# Altium schematic sheet P5c_Filter1B.SchDoc
size A
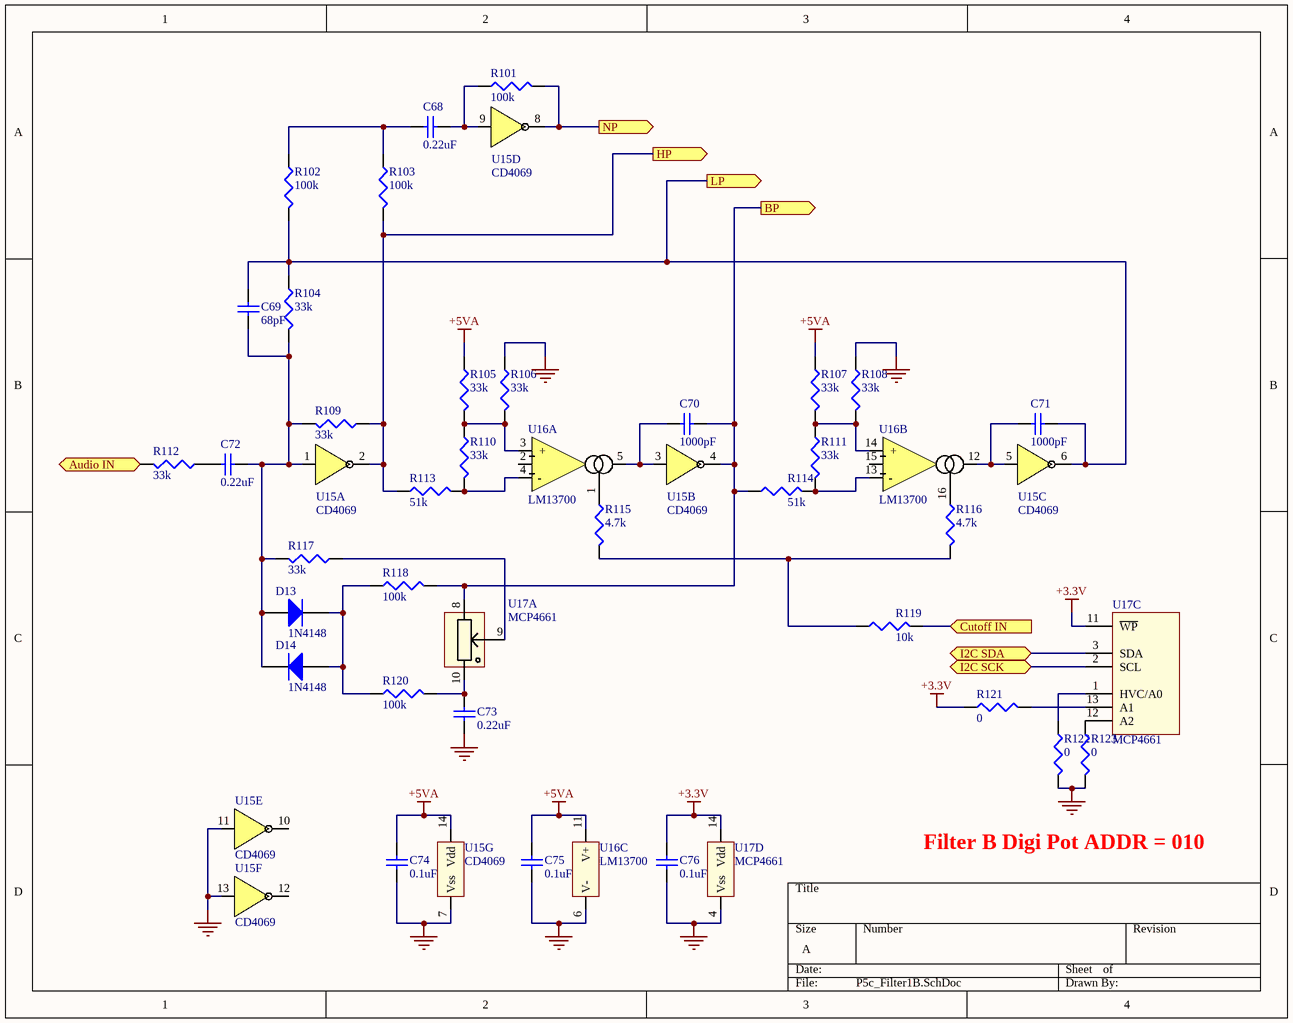
[diagram p0: P5c_Filter1B.SchDoc]

## Parts
C68  0.22uF  [CAP 0603 (1608 metric)]
C69  68pF  [CAP 0603 (1608 metric)]
C70  1000pF  [CAP 0603 (1608 metric)]
C71  1000pF  [CAP 0603 (1608 metric)]
C72  0.22uF  [CAP 0603 (1608 metric)]
C73  0.22uF  [CAP 0603 (1608 metric)]
C74  0.1uF  [CAP 0603 (1608 metric)]
C75  0.1uF  [CAP 0603 (1608 metric)]
C76  0.1uF  [CAP 0603 (1608 metric)]
D13  1N4148
D14  1N4148
R101  100k  [RES 0603 (1608 metric)]
R102  100k  [RES 0603 (1608 metric)]
R103  100k  [RES 0603 (1608 metric)]
R104  33k  [RES 0603 (1608 metric)]
R105  33k  [RES 0603 (1608 metric)]
R106  33k  [RES 0603 (1608 metric)]
R107  33k  [RES 0603 (1608 metric)]
R108  33k  [RES 0603 (1608 metric)]
R109  33k  [RES 0603 (1608 metric)]
R110  33k  [RES 0603 (1608 metric)]
R111  33k  [RES 0603 (1608 metric)]
R112  33k  [RES 0603 (1608 metric)]
R113  51k  [RES 0603 (1608 metric)]
R114  51k  [RES 0603 (1608 metric)]
R115  4.7k  [RES 0603 (1608 metric)]
R116  4.7k  [RES 0603 (1608 metric)]
R117  33k  [RES 0603 (1608 metric)]
R118  100k  [RES 0603 (1608 metric)]
R119  10k  [RES 0603 (1608 metric)]
R120  100k  [RES 0603 (1608 metric)]
R121  0  [RES 0603 (1608 metric)]
R122  0  [RES 0603 (1608 metric)]
R123  0  [RES 0603 (1608 metric)]
U15  CD4069  (parts A,B,C,D,E,F,G of 7)
U16  LM13700  (parts A,B,C of 3)
U17  MCP4661  (parts A,C,D of 4)

## Ports
Audio IN (in), BP (out), Cutoff IN (in), HP (out), I2C SCK, I2C SDA, LP (out), NP (out)

## Nets
+3.3V: C76.1 R121.1 U17.11(~{WP}) U17.14(Vdd)
+5VA: C74.1 C75.1 R105.1 R107.1 U15.14(Vdd) U16.11(V+)
GND: C73.2 C74.2 C75.2 C76.2 R106.1 R108.1 R122.2 R123.2 U15.7(Vss) U15.11(E) U15.13(F) U16.6(V-) U17.4(Vss)
Audio IN: R112.2 ; port Audio IN
BP: C70.2 R114.1 R118.2 U15.4(~{B}) U17.8(P0A) ; port BP
Cutoff IN: R119.2 ; port Cutoff IN
HP: R103.2 R109.1 R113.1 U15.2(~{A}) ; port HP
I2C SCK: U17.2(SCL) ; port I2C SCK
I2C SDA: U17.3(SDA) ; port I2C SDA
LP: C69.2 C71.2 R102.2 R104.1 U15.6(~{C}) ; port LP
NP: R101.2 U15.8(~{D}) ; port NP
NetC68_1: C68.1 R102.1 R103.1
NetC68_2: C68.2 R101.1 U15.9(D)
NetC69_1: C69.1 C72.2 D13.1(A) D14.2(K) R104.2 R109.2 R117.2 U15.1(A)
NetC70_1: C70.1 U15.3(B) U16.5(OUT)
NetC71_1: C71.1 U15.5(C) U16.12(OUT)
NetC72_1: C72.1 R112.1
NetC73_1: C73.1 R120.2 U17.10(P0B)
NetD13_2: D13.2(K) D14.1(A) R118.1 R120.1
NetR105_2: R105.2 R106.2 R110.1 U16.3(+)
NetR107_2: R107.2 R108.2 R111.1 U16.14(+)
NetR110_2: R110.2 R113.2 U16.4(-)
NetR111_2: R111.2 R114.2 U16.13(-)
NetR115_1: R115.1 U16.1(BIAS)
NetR115_2: R115.2 R116.2 R119.1
NetR116_1: R116.1 U16.16(BIAS)
NetR117_1: R117.1 U17.9(P0W)
NetR121_2: R121.2 U17.13(A1)
NetR122_1: R122.1 U17.1(HVC/A0)
NetR123_1: R123.1 U17.12(A2)

Not connected (* = marked no-connect by the designer): U15 10(~{E}) 12(~{F}); U16 2(Diode_BIAS) 15(Diode_BIAS)

## Notes on the sheet
- Filter B Digi Pot ADDR = 010

## Library data of the parts
C68-C76 = Cap Semi: Capacitor (Semiconductor SIM Model)
  C68 C72 C73: Value: 0.22uF
  C69: Value: 68pF
  C70 C71: Value: 1000pF
  C74-C76: Value: 0.1uF
D13 D14 = Diode 1N4148: High Conductance Fast Diode
R101-R123 = Res3: Resistor
  R101-R103 R118 R120: Value: 100k
  R104-R112 R117: Value: 33k
  R113 R114: Value: 51k
  R115 R116: Value: 4.7k
  R119: Value: 10k
  R121-R123: Value: 0
U15 = CD4069: Hex Inverter
U16 = LM13700M: Dual Transconductance OpAmp
U17 = MCP4661: Dual DigiPot non volatile I2C